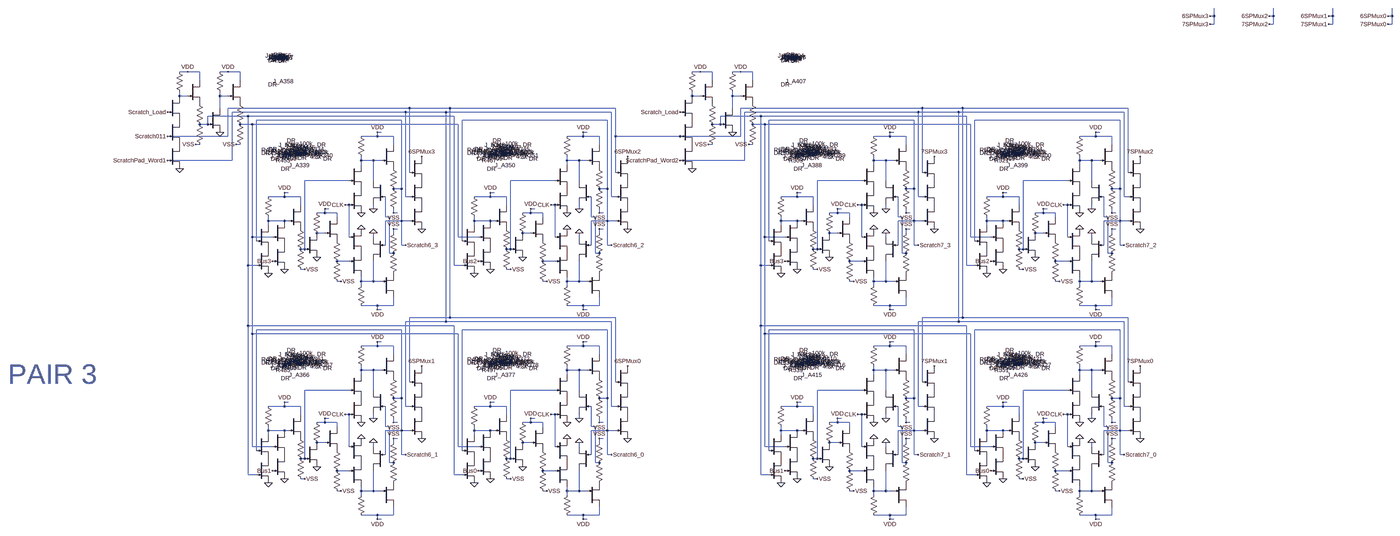
[diagram p0: schematic Pair 4.asc, whole sheet]
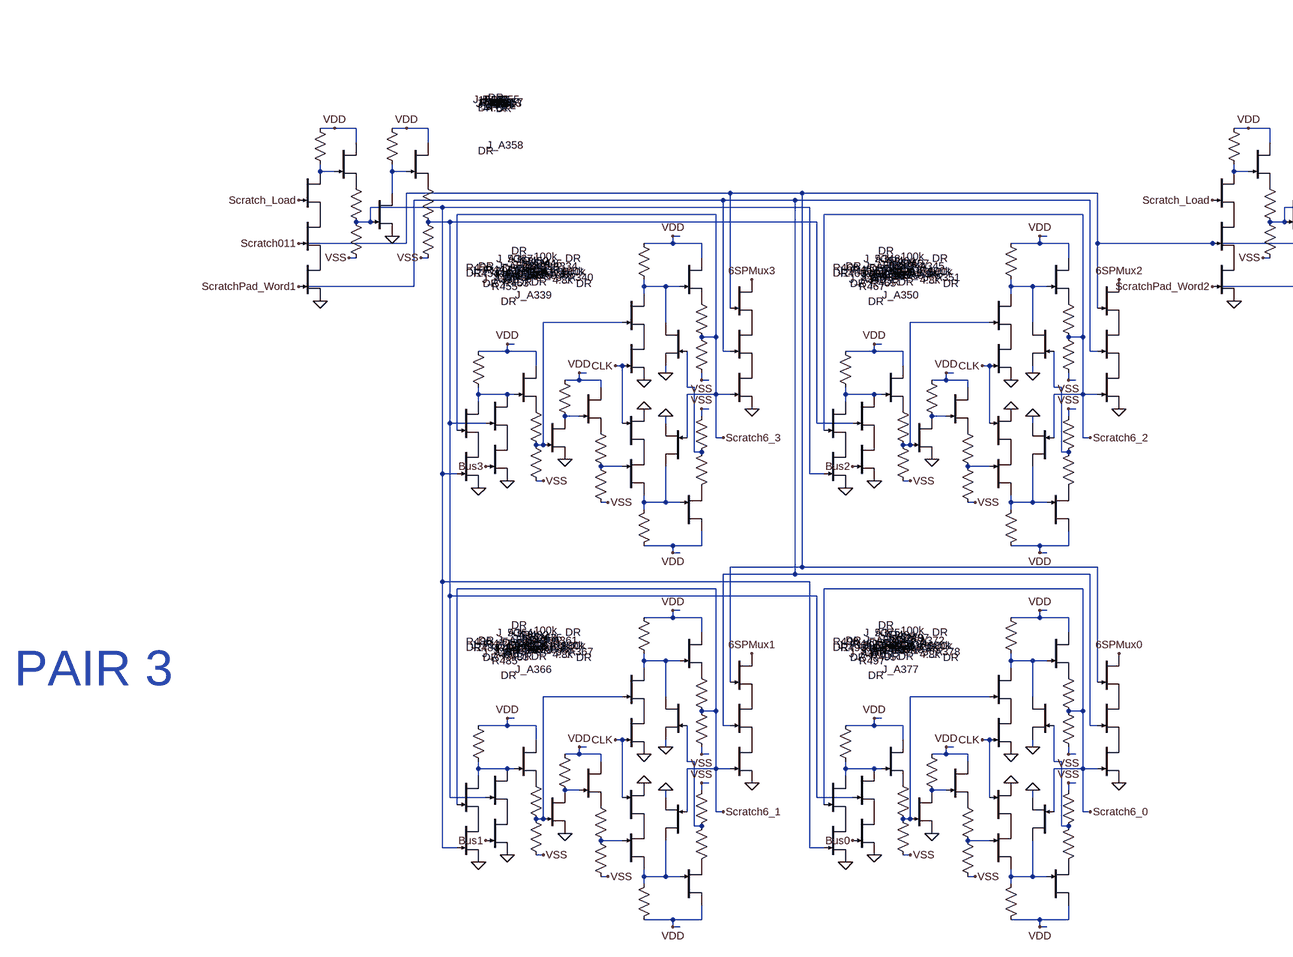
[diagram p1: schematic Pair 4.asc, part, row 1 of 1, column 1 of 2]
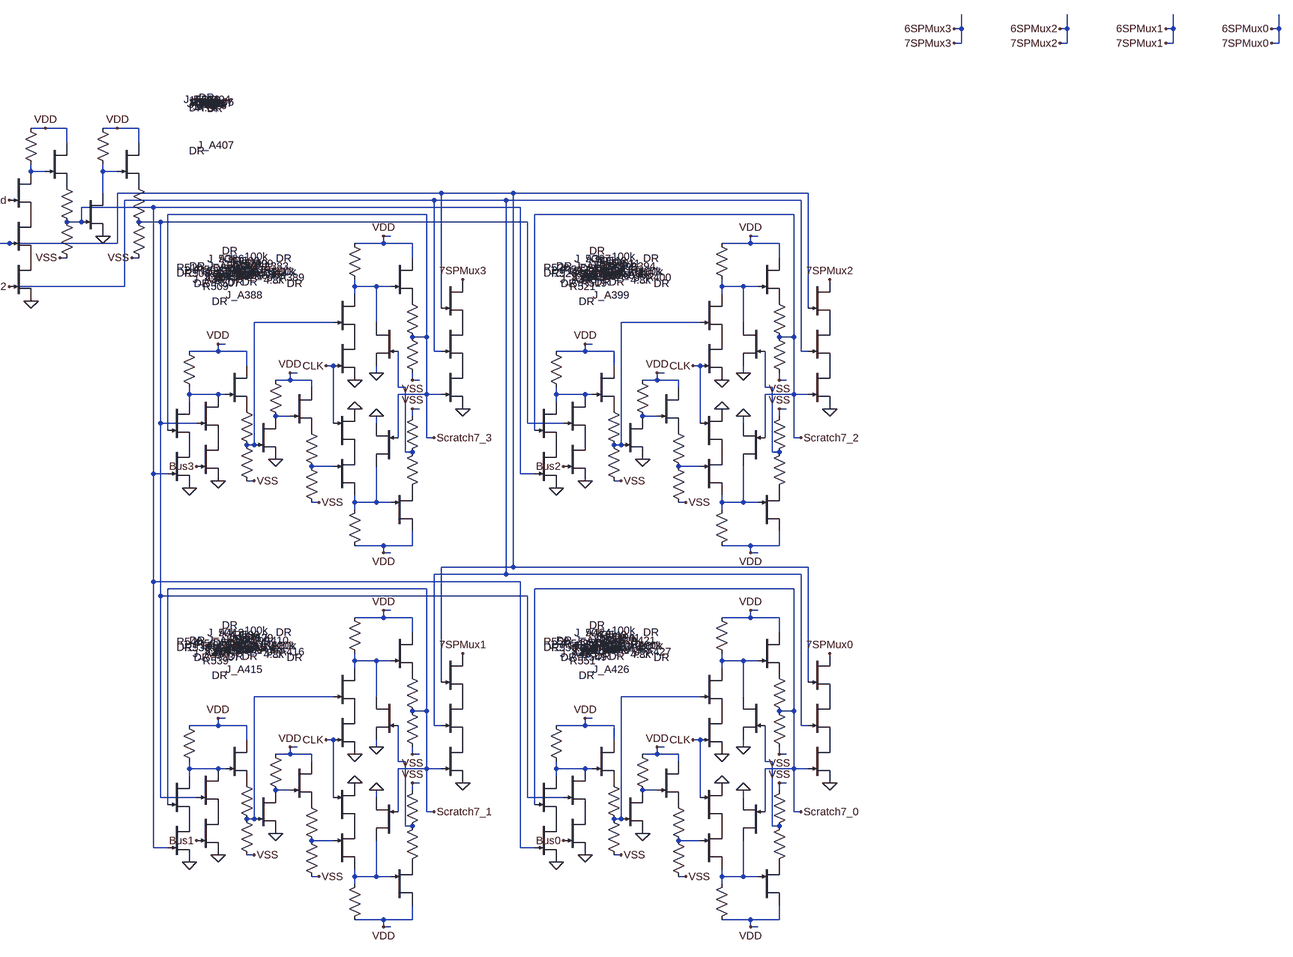
[diagram p2: schematic Pair 4.asc, part, row 1 of 1, column 2 of 2]
* Pair 4.asc
J_A332 N009 N013 P001 DR
R445 VDD N009 100k
J_F120 VDD N009 P002 DR
R446 P002 Scratch6_3 1k
R447 Scratch6_3 VSS 4.8k
J_B113 N009 N017 0 DR
J_A333 N033 N029 P003 DR
R448 VDD N033 100k
J_F121 VDD N033 P004 DR
R449 P004 N017 1k
R450 N017 VSS 4.8k
J_B114 N033 Scratch6_3 0 DR
J_A334 P001 CLK 0 DR
J_A335 P003 CLK 0 DR
J_A336 N021 Scratch6_3 P005 DR
R451 VDD N021 100k
J_F122 VDD N021 P006 DR
R452 P006 N013 1k
R453 N013 VSS 4.8k
J_B115 N021 N007 P007 DR
J_A337 N025 N013 0 DR
R454 VDD N025 50k
J_A338 VDD N025 P008 DR
R455 P008 N029 1k
R456 N029 VSS 4.5k
J_A339 P005 N005 0 DR
J_B116 P007 Bus3 0 DR
J_A340 P009 Scratch6_3 0 DR
J_A341 P010 ScratchPad_Word1 P009 DR
J_A342 7SPMux3 Scratch011 P010 DR
J_A343 N010 N014 P011 DR
R457 VDD N010 100k
J_F123 VDD N010 P012 DR
R458 P012 Scratch6_2 1k
R459 Scratch6_2 VSS 4.8k
J_B117 N010 N018 0 DR
J_A344 N034 N030 P013 DR
R460 VDD N034 100k
J_F124 VDD N034 P014 DR
R461 P014 N018 1k
R462 N018 VSS 4.8k
J_B118 N034 Scratch6_2 0 DR
J_A345 P011 CLK 0 DR
J_A346 P013 CLK 0 DR
J_A347 N022 Scratch6_2 P015 DR
R463 VDD N022 100k
J_F125 VDD N022 P016 DR
R464 P016 N014 1k
R465 N014 VSS 4.8k
J_B119 N022 N007 P017 DR
J_A348 N026 N014 0 DR
R466 VDD N026 50k
J_A349 VDD N026 P018 DR
R467 P018 N030 1k
R468 N030 VSS 4.5k
J_A350 P015 N005 0 DR
J_B120 P017 Bus2 0 DR
J_A351 P019 Scratch6_2 0 DR
J_A352 P020 ScratchPad_Word1 P019 DR
J_A353 7SPMux2 Scratch011 P020 DR
R469 VDD N001 100k
J_F126 VDD N001 P021 DR
R470 P021 N005 1k
R471 N005 VSS 4.8k
J_A354 N002 N005 0 DR
R472 VDD N002 50k
J_A355 VDD N002 P022 DR
R473 P022 N007 1k
R474 VSS N007 4.5k
J_A356 N001 Scratch_Load P023 DR
J_A357 P023 Scratch011 P024 DR
J_A358 P024 ScratchPad_Word1 0 DR
J_A359 N037 N041 P025 DR
R475 VDD N037 100k
J_F127 VDD N037 P026 DR
R476 P026 Scratch6_1 1k
R477 Scratch6_1 VSS 4.8k
J_B121 N037 N045 0 DR
J_A360 N061 N057 P027 DR
R478 VDD N061 100k
J_F128 VDD N061 P028 DR
R479 P028 N045 1k
R480 N045 VSS 4.8k
J_B122 N061 Scratch6_1 0 DR
J_A361 P025 CLK 0 DR
J_A362 P027 CLK 0 DR
J_A363 N049 Scratch6_1 P029 DR
R481 VDD N049 100k
J_F129 VDD N049 P030 DR
R482 P030 N041 1k
R483 N041 VSS 4.8k
J_B123 N049 N007 P031 DR
J_A364 N053 N041 0 DR
R484 VDD N053 50k
J_A365 VDD N053 P032 DR
R485 P032 N057 1k
R486 N057 VSS 4.5k
J_A366 P029 N005 0 DR
J_B124 P031 Bus1 0 DR
J_A367 P033 Scratch6_1 0 DR
J_A368 P034 ScratchPad_Word1 P033 DR
J_A369 7SPMux1 Scratch011 P034 DR
J_A370 N038 N042 P035 DR
R487 VDD N038 100k
J_F130 VDD N038 P036 DR
R488 P036 Scratch6_0 1k
R489 Scratch6_0 VSS 4.8k
J_B125 N038 N046 0 DR
J_A371 N062 N058 P037 DR
R490 VDD N062 100k
J_F131 VDD N062 P038 DR
R491 P038 N046 1k
R492 N046 VSS 4.8k
J_B126 N062 Scratch6_0 0 DR
J_A372 P035 CLK 0 DR
J_A373 P037 CLK 0 DR
J_A374 N050 Scratch6_0 P039 DR
R493 VDD N050 100k
J_F132 VDD N050 P040 DR
R494 P040 N042 1k
R495 N042 VSS 4.8k
J_B127 N050 N007 P041 DR
J_A375 N054 N042 0 DR
R496 VDD N054 50k
J_A376 VDD N054 P042 DR
R497 P042 N058 1k
R498 N058 VSS 4.5k
J_A377 P039 N005 0 DR
J_B128 P041 Bus0 0 DR
J_A378 P043 Scratch6_0 0 DR
J_A379 P044 ScratchPad_Word1 P043 DR
J_A380 7SPMux0 Scratch011 P044 DR
J_A381 N011 N015 P045 DR
R499 VDD N011 100k
J_F133 VDD N011 P046 DR
R500 P046 Scratch7_3 1k
R501 Scratch7_3 VSS 4.8k
J_B129 N011 N019 0 DR
J_A382 N035 N031 P047 DR
R502 VDD N035 100k
J_F134 VDD N035 P048 DR
R503 P048 N019 1k
R504 N019 VSS 4.8k
J_B130 N035 Scratch7_3 0 DR
J_A383 P045 CLK 0 DR
J_A384 P047 CLK 0 DR
J_A385 N023 Scratch7_3 P049 DR
R505 VDD N023 100k
J_F135 VDD N023 P050 DR
R506 P050 N015 1k
R507 N015 VSS 4.8k
J_B131 N023 N008 P051 DR
J_A386 N027 N015 0 DR
R508 VDD N027 50k
J_A387 VDD N027 P052 DR
R509 P052 N031 1k
R510 N031 VSS 4.5k
J_A388 P049 N006 0 DR
J_B132 P051 Bus3 0 DR
J_A389 P053 Scratch7_3 0 DR
J_A390 P054 ScratchPad_Word2 P053 DR
J_A391 7SPMux3 Scratch011 P054 DR
J_A392 N012 N016 P055 DR
R511 VDD N012 100k
J_F136 VDD N012 P056 DR
R512 P056 Scratch7_2 1k
R513 Scratch7_2 VSS 4.8k
J_B133 N012 N020 0 DR
J_A393 N036 N032 P057 DR
R514 VDD N036 100k
J_F137 VDD N036 P058 DR
R515 P058 N020 1k
R516 N020 VSS 4.8k
J_B134 N036 Scratch7_2 0 DR
J_A394 P055 CLK 0 DR
J_A395 P057 CLK 0 DR
J_A396 N024 Scratch7_2 P059 DR
R517 VDD N024 100k
J_F138 VDD N024 P060 DR
R518 P060 N016 1k
R519 N016 VSS 4.8k
J_B135 N024 N008 P061 DR
J_A397 N028 N016 0 DR
R520 VDD N028 50k
J_A398 VDD N028 P062 DR
R521 P062 N032 1k
R522 N032 VSS 4.5k
J_A399 P059 N006 0 DR
J_B136 P061 Bus2 0 DR
J_A400 P063 Scratch7_2 0 DR
J_A401 P064 ScratchPad_Word2 P063 DR
J_A402 7SPMux2 Scratch011 P064 DR
R523 VDD N003 100k
J_F139 VDD N003 P065 DR
R524 P065 N006 1k
R525 N006 VSS 4.8k
J_A403 N004 N006 0 DR
R526 VDD N004 50k
J_A404 VDD N004 P066 DR
R527 P066 N008 1k
R528 VSS N008 4.5k
J_A405 N003 Scratch_Load P067 DR
J_A406 P067 Scratch011 P068 DR
J_A407 P068 ScratchPad_Word2 0 DR
J_A408 N039 N043 P069 DR
R529 VDD N039 100k
J_F140 VDD N039 P070 DR
R530 P070 Scratch7_1 1k
R531 Scratch7_1 VSS 4.8k
J_B137 N039 N047 0 DR
J_A409 N063 N059 P071 DR
R532 VDD N063 100k
J_F141 VDD N063 P072 DR
R533 P072 N047 1k
R534 N047 VSS 4.8k
J_B138 N063 Scratch7_1 0 DR
J_A410 P069 CLK 0 DR
J_A411 P071 CLK 0 DR
J_A412 N051 Scratch7_1 P073 DR
R535 VDD N051 100k
J_F142 VDD N051 P074 DR
R536 P074 N043 1k
R537 N043 VSS 4.8k
J_B139 N051 N008 P075 DR
J_A413 N055 N043 0 DR
R538 VDD N055 50k
J_A414 VDD N055 P076 DR
R539 P076 N059 1k
R540 N059 VSS 4.5k
J_A415 P073 N006 0 DR
J_B140 P075 Bus1 0 DR
J_A416 P077 Scratch7_1 0 DR
J_A417 P078 ScratchPad_Word2 P077 DR
J_A418 7SPMux1 Scratch011 P078 DR
J_A419 N040 N044 P079 DR
R541 VDD N040 100k
J_F143 VDD N040 P080 DR
R542 P080 Scratch7_0 1k
R543 Scratch7_0 VSS 4.8k
J_B141 N040 N048 0 DR
J_A420 N064 N060 P081 DR
R544 VDD N064 100k
J_F144 VDD N064 P082 DR
R545 P082 N048 1k
R546 N048 VSS 4.8k
J_B142 N064 Scratch7_0 0 DR
J_A421 P079 CLK 0 DR
J_A422 P081 CLK 0 DR
J_A423 N052 Scratch7_0 P083 DR
R547 VDD N052 100k
J_F145 VDD N052 P084 DR
R548 P084 N044 1k
R549 N044 VSS 4.8k
J_B143 N052 N008 P085 DR
J_A424 N056 N044 0 DR
R550 VDD N056 50k
J_A425 VDD N056 P086 DR
R551 P086 N060 1k
R552 N060 VSS 4.5k
J_A426 P083 N006 0 DR
J_B144 P085 Bus0 0 DR
J_A427 P087 Scratch7_0 0 DR
J_A428 P088 ScratchPad_Word2 P087 DR
J_A429 7SPMux0 Scratch011 P088 DR
.model NJF NJF
.model PJF PJF
.lib standard.jft
* PAIR 3
.backanno
.end